# EAGLE schematic F6779 Ver 2.1 (EAGLE 7.7.0)

## Sheet 1 of 4
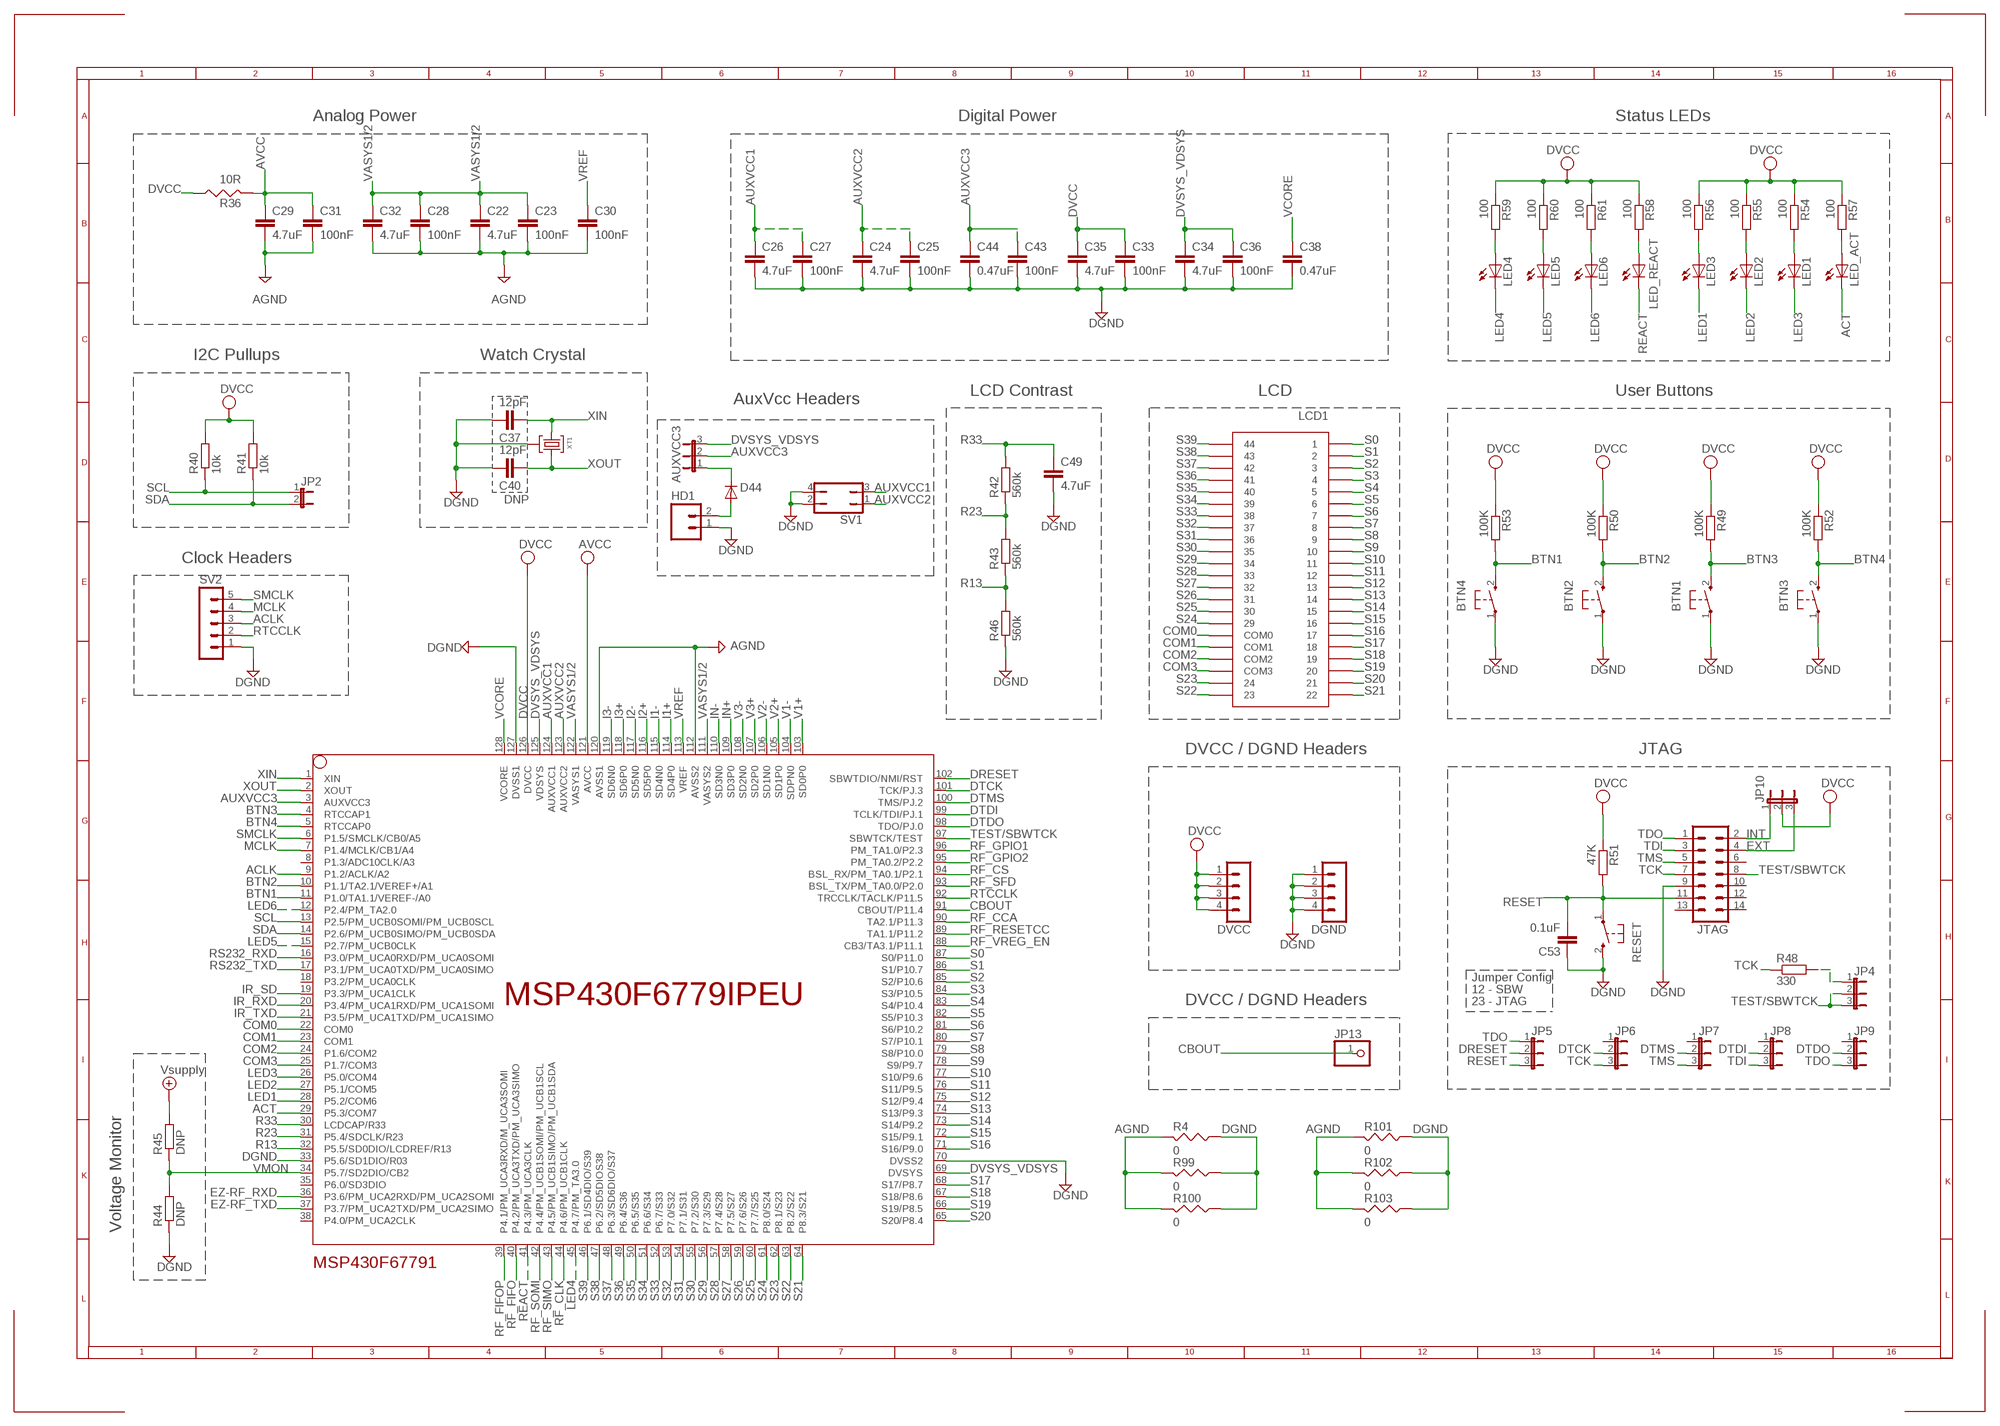
[diagram p0: schematic, sheet 1]

### Parts
AUXVCC3  JP2E  [JP2]
BTN1  PB  [PBTH]
BTN2  PB  [PBTH]
BTN3  PB  [PBTH]
BTN4  PB  [PBTH]
C22  4.7uF  C-EUC0603  [C0603]
C23  100nF  C-EUC0603  [C0603]
C24  4.7uF  C-EUC0603  [C0603]
C25  100nF  C-EUC0603  [C0603]
C26  4.7uF  C-EUC0603  [C0603]
C27  100nF  C-EUC0603  [C0603]
C28  100nF  C-EUC0603  [C0603]
C29  4.7uF  C-EUC0603  [C0603]
C30  100nF  C-EUC0603  [C0603]
C31  100nF  C-EUC0603  [C0603]
C32  4.7uF  C-EUC0603  [C0603]
C33  100nF  C-EUC0603  [C0603]
C34  4.7uF  C-EUC0603  [C0603]
C35  4.7uF  C-EUC0603  [C0603]
C36  100nF  C-EUC0603  [C0603]
C37  12pF  C-EUC0603  [C0603]
C38  0.47uF  C-EUC0603  [C0603]
C40  12pF  C-EUC0603  [C0603]
C43  100nF  C-EUC0603  [C0603]
C44  0.47uF  C-EUC0603  [C0603]
C49  4.7uF  C-EUC0603  [C0603]
C53  0.1uF  C-EUC0603  [C0603]
D44  PMLL4148  [SOD80C]
DGND  MA04-1  [MA04-1]
DVCC  MA04-1  [MA04-1]
HD1  M02PTH  [1X02]
JP2  JP1E  [JP1]
JP4  JP2E  [JP2]
JP5  JP2E  [JP2]
JP6  JP2E  [JP2]
JP7  JP2E  [JP2]
JP8  JP2E  [JP2]
JP9  JP2E  [JP2]
JP10  JP2E  [JP2]
JP13  PINHD-1X1  [1X01]
JTAG  ML14  [ML14]
LCD1  TI_160SEG_LCD  [TI_160SEG_LCD]
LED1  LED3MM  [LED3MM]
LED2  LED3MM  [LED3MM]
LED3  LED3MM  [LED3MM]
LED4  LED3MM  [LED3MM]
LED5  LED3MM  [LED3MM]
LED6  LED3MM  [LED3MM]
LED_ACT  LED3MM  [LED3MM]
LED_REACT  LED3MM  [LED3MM]
MSP430F67791  MSP430F6779IPEU  [PEU128]
R4  0  RES0805  [R0805]
R36  10R  RES0805  [R0805]
R40  10k  R-EU_R0603  [R0603]
R41  10k  R-EU_R0603  [R0603]
R42  560k  R-EU_R0603  [R0603]
R43  560k  R-EU_R0603  [R0603]
R44  DNP  R-EU_R0603  [R0603]
R45  DNP  R-EU_R0603  [R0603]
R46  560k  R-EU_R0603  [R0603]
R48  330  R-EU_R0603  [R0603]
R49  100K  R-EU_R0603  [R0603]
R50  100K  R-EU_R0603  [R0603]
R51  47K  R-EU_R0603  [R0603]
R52  100K  R-EU_R0603  [R0603]
R53  100K  R-EU_R0603  [R0603]
R54  100  R-EU_R0603  [R0603]
R55  100  R-EU_R0603  [R0603]
R56  100  R-EU_R0603  [R0603]
R57  100  R-EU_R0603  [R0603]
R58  100  R-EU_R0603  [R0603]
R59  100  R-EU_R0603  [R0603]
R60  100  R-EU_R0603  [R0603]
R61  100  R-EU_R0603  [R0603]
R99  0  RES0805  [R0805]
R100  0  RES0805  [R0805]
R101  0  RES0805  [R0805]
R102  0  RES0805  [R0805]
R103  0  RES0805  [R0805]
RESET  PB  [PBTH]
SV1  JP2Q  [JP2Q]
SV2  MA05-1  [MA05-1]
XT1  CM200T  [CM200T]

### Nets
ACLK: MSP430F67791.9(P1.2/ACLK/A2) SV2.3
ACT: LED_ACT.K(C) MSP430F67791.29(P5.3/COM7) ; also sheet 4
AGND: C22.2 C23.2 C28.2 C29.2 C30.2 C31.2 C32.2 MSP430F67791.112(AVSS2) MSP430F67791.120(AVSS1) R4.2 R99.2 R100.2 R101.2 R102.2 R103.2 ; also sheet 2
AUXVCC1: C26.1 C27.1 MSP430F67791.124(AUXVCC1) SV1.3
AUXVCC2: C24.1 C25.1 MSP430F67791.123(AUXVCC2) SV1.1
AUXVCC3: AUXVCC3.2 C43.1 C44.1 MSP430F67791.3(AUXVCC3)
AVCC: C29.1 C31.1 MSP430F67791.121(AVCC) R36.2 ; also sheet 2
BTN1: BTN4.2(S) MSP430F67791.11(P1.0/TA1.1/VEREF-/A0) R53.2
BTN2: BTN2.2(S) MSP430F67791.10(P1.1/TA2.1/VEREF+/A1) R50.2
BTN3: BTN1.2(S) MSP430F67791.4(RTCCAP1) R49.2
BTN4: BTN3.2(S) MSP430F67791.5(RTCCAP0) R52.2
CBOUT: JP13.1 MSP430F67791.91(CBOUT/P11.4)
COM0: LCD1.COM0 MSP430F67791.22(COM0)
COM1: LCD1.COM1 MSP430F67791.23(COM1)
COM2: LCD1.COM2 MSP430F67791.24(P1.6/COM2)
COM3: LCD1.COM3 MSP430F67791.25(P1.7/COM3)
DGND: BTN1.1(P) BTN2.1(P) BTN3.1(P) BTN4.1(P) C24.2 C25.2 C26.2 C27.2 C33.2 C34.2 C35.2 C36.2 C37.2 C38.2 C40.2 C43.2 C44.2 C49.2 C53.1 DGND.1 DGND.2 DGND.3 DGND.4 HD1.1 JTAG.9 MSP430F67791.33(P5.6/SD1DIO/R03) MSP430F67791.70(DVSS2) MSP430F67791.127(DVSS1) R4.1 R44.1 R46.1 R99.1 R100.1 R101.1 R102.1 R103.1 RESET.2(S) SV1.2 SV1.4 SV2.1 XT1.P3 ; also sheet 3,4
DRESET: JP5.2 MSP430F67791.102(SBWTDIO/NMI/RST)
DTCK: JP6.2 MSP430F67791.101(TCK/PJ.3)
DTDI: JP8.2 MSP430F67791.99(TCLK/TDI/PJ.1)
DTDO: JP9.2 MSP430F67791.98(TDO/PJ.0)
DTMS: JP7.2 MSP430F67791.100(TMS/PJ.2)
DVCC: C33.1 C35.1 DVCC.1 DVCC.2 DVCC.3 DVCC.4 JP10.2 MSP430F67791.126(DVCC) R36.1 R40.2 R41.2 R49.1 R50.1 R51.1 R52.1 R53.1 R54.1 R55.1 R56.1 R57.1 R58.1 R59.1 R60.1 R61.1 ; also sheet 3,4
DVSYS_VDSYS: AUXVCC3.3 C34.1 C36.1 MSP430F67791.69(DVSYS) MSP430F67791.125(VDSYS)
EXT: JP10.3 JTAG.4
EZ-RF_RXD: MSP430F67791.36(P3.6/PM_UCA2RXD/PM_UCA2SOMI) ; also sheet 4
EZ-RF_TXD: MSP430F67791.37(P3.7/PM_UCA2TXD/PM_UCA2SIMO) ; also sheet 4
I1+: MSP430F67791.114(SD4P0) ; also sheet 2
I1-: MSP430F67791.115(SD4N0) ; also sheet 2
I2+: MSP430F67791.116(SD5P0) ; also sheet 2
I2-: MSP430F67791.117(SD5N0) ; also sheet 2
I3+: MSP430F67791.118(SD6P0) ; also sheet 2
I3-: MSP430F67791.119(SD6N0) ; also sheet 2
IN+: MSP430F67791.109(SD3P0) ; also sheet 2
IN-: MSP430F67791.110(SD3N0) ; also sheet 2
INT: JP10.1 JTAG.2
IR_RXD: MSP430F67791.20(P3.4/PM_UCA1RXD/PM_UCA1SOMI) ; also sheet 4
IR_SD: MSP430F67791.19(P3.3/PM_UCA1CLK) ; also sheet 4
IR_TXD: MSP430F67791.21(P3.5/PM_UCA1TXD/PM_UCA1SIMO) ; also sheet 4
LED1: LED3.K(C) MSP430F67791.28(P5.2/COM6)
LED2: LED2.K(C) MSP430F67791.27(P5.1/COM5)
LED3: LED1.K(C) MSP430F67791.26(P5.0/COM4)
LED4: LED4.K(C) MSP430F67791.45(P4.7/PM_TA3.0)
LED5: LED5.K(C) MSP430F67791.15(P2.7/PM_UCB0CLK)
LED6: LED6.K(C) MSP430F67791.12(P2.4/PM_TA2.0)
MCLK: MSP430F67791.7(P1.4/MCLK/CB1/A4) SV2.4
N$4: LED3.A R56.2
N$5: AUXVCC3.1 D44.C
N$7: LED2.A R55.2
N$10: JP4.1 R48.2
N$21: LED4.A R59.2
N$27: LED5.A R60.2
N$30: LED1.A R54.2
N$36: LED6.A R61.2
N$44: LED_REACT.A R58.2
N$46: LED_ACT.A R57.2
N$49: D44.A HD1.2
R13: MSP430F67791.32(P5.5/SD0DIO/LCDREF/R13) R43.1 R46.2
R23: MSP430F67791.31(P5.4/SDCLK/R23) R42.1 R43.2
R33: C49.1 MSP430F67791.30(LCDCAP/R33) R42.2
REACT: LED_REACT.K(C) MSP430F67791.41(P4.3/PM_UCA3CLK) ; also sheet 4
RESET: C53.2 JP5.3 JTAG.11 R51.2 RESET.1(P)
RF_CCA: MSP430F67791.90(TA2.1/P11.3) ; also sheet 4
RF_CLK: MSP430F67791.44(P4.6/PM_UCB1CLK) ; also sheet 4
RF_CS: MSP430F67791.94(BSL_RX/PM_TA0.1/P2.1) ; also sheet 4
RF_FIFO: MSP430F67791.40(P4.2/PM_UCA3TXD/PM_UCA3SIMO) ; also sheet 4
RF_FIFOP: MSP430F67791.39(P4.1/PM_UCA3RXD/M_UCA3SOMI) ; also sheet 4
RF_GPIO1: MSP430F67791.96(PM_TA1.0/P2.3) ; also sheet 4
RF_GPIO2: MSP430F67791.95(PM_TA0.2/P2.2) ; also sheet 4
RF_RESETCC: MSP430F67791.89(TA1.1/P11.2) ; also sheet 4
RF_SFD: MSP430F67791.93(BSL_TX/PM_TA0.0/P2.0) ; also sheet 4
RF_SIMO: MSP430F67791.43(P4.5/PM_UCB1SIMO/PM_UCB1SDA) ; also sheet 4
RF_SOMI: MSP430F67791.42(P4.4/PM_UCB1SOMI/PM_UCB1SCL) ; also sheet 4
RF_VREG_EN: MSP430F67791.88(CB3/TA3.1/P11.1) ; also sheet 4
RS232_RXD: MSP430F67791.16(P3.0/PM_UCA0RXD/PM_UCA0SOMI) ; also sheet 4
RS232_TXD: MSP430F67791.17(P3.1/PM_UCA0TXD/PM_UCA0SIMO) ; also sheet 4
RTCCLK: MSP430F67791.92(TRCCLK/TACLK/P11.5) SV2.2
S0: LCD1.1 MSP430F67791.87(S0/P11.0)
S1: LCD1.2 MSP430F67791.86(S1/P10.7)
S2: LCD1.3 MSP430F67791.85(S2/P10.6)
S3: LCD1.4 MSP430F67791.84(S3/P10.5)
S4: LCD1.5 MSP430F67791.83(S4/P10.4)
S5: LCD1.6 MSP430F67791.82(S5/P10.3)
S6: LCD1.7 MSP430F67791.81(S6/P10.2)
S7: LCD1.8 MSP430F67791.80(S7/P10.1)
S8: LCD1.9 MSP430F67791.79(S8/P10.0)
S9: LCD1.10 MSP430F67791.78(S9/P9.7)
S10: LCD1.11 MSP430F67791.77(S10/P9.6)
S11: LCD1.12 MSP430F67791.76(S11/P9.5)
S12: LCD1.13 MSP430F67791.75(S12/P9.4)
S13: LCD1.14 MSP430F67791.74(S13/P9.3)
S14: LCD1.15 MSP430F67791.73(S14/P9.2)
S15: LCD1.16 MSP430F67791.72(S15/P9.1)
S16: LCD1.17 MSP430F67791.71(S16/P9.0)
S17: LCD1.18 MSP430F67791.68(S17/P8.7)
S18: LCD1.19 MSP430F67791.67(S18/P8.6)
S19: LCD1.20 MSP430F67791.66(S19/P8.5)
S20: LCD1.21 MSP430F67791.65(S20/P8.4)
S21: LCD1.22 MSP430F67791.64(P8.3/S21)
S22: LCD1.23 MSP430F67791.63(P8.2/S22)
S23: LCD1.24 MSP430F67791.62(P8.1/S23)
S24: LCD1.29 MSP430F67791.61(P8.0/S24)
S25: LCD1.30 MSP430F67791.60(P7.7/S25)
S26: LCD1.31 MSP430F67791.59(P7.6/S26)
S27: LCD1.32 MSP430F67791.58(P7.5/S27)
S28: LCD1.33 MSP430F67791.57(P7.4/S28)
S29: LCD1.34 MSP430F67791.56(P7.3/S29)
S30: LCD1.35 MSP430F67791.55(P7.2/S30)
S31: LCD1.36 MSP430F67791.54(P7.1/S31)
S32: LCD1.37 MSP430F67791.53(P7.0/S32)
S33: LCD1.38 MSP430F67791.52(P6.7/S33)
S34: LCD1.39 MSP430F67791.51(P6.6/S34)
S35: LCD1.40 MSP430F67791.50(P6.5/S35)
S36: LCD1.41 MSP430F67791.49(P6.4/S36)
S37: LCD1.42 MSP430F67791.48(P6.3/SD6DIO/S37)
S38: LCD1.43 MSP430F67791.47(P6.2/SD5DIOS38)
S39: LCD1.44 MSP430F67791.46(P6.1/SD4DIO/S39)
SCL: JP2.1 MSP430F67791.13(P2.5/PM_UCB0SOMI/PM_UCB0SCL) R40.1 ; also sheet 4
SDA: JP2.2 MSP430F67791.14(P2.6/PM_UCB0SIMO/PM_UCB0SDA) R41.1 ; also sheet 4
SMCLK: MSP430F67791.6(P1.5/SMCLK/CB0/A5) SV2.5
TCK: JP6.3 JTAG.7 R48.1
TDI: JP8.3 JTAG.3
TDO: JP5.1 JP9.3 JTAG.1
TEST/SBWTCK: JP4.2 JP4.3 JTAG.8 MSP430F67791.97(SBWTCK/TEST)
TMS: JP7.3 JTAG.5
V1+: MSP430F67791.103(SD0P0) ; also sheet 2
V1-: MSP430F67791.104(SDPN0) ; also sheet 2
V2+: MSP430F67791.105(SD1P0) ; also sheet 2
V2-: MSP430F67791.106(SD1N0) ; also sheet 2
V3+: MSP430F67791.107(SD2P0) ; also sheet 2
V3-: MSP430F67791.108(SD2N0) ; also sheet 2
VASYS1/2: C22.1 C23.1 C28.1 C32.1 MSP430F67791.111(VASYS2) MSP430F67791.122(VASYS1)
VCORE: C38.1 MSP430F67791.128(VCORE)
VMON: MSP430F67791.34(P5.7/SD2DIO/CB2) R44.2 R45.1
VREF: C30.1 MSP430F67791.113(VREF)
VSUPPLY: R45.2 ; supply symbol labelled Vsupply ; also sheet 3
XIN: C37.1 MSP430F67791.1(XIN) XT1.P2
XOUT: C40.1 MSP430F67791.2(XOUT) XT1.P1
Unconnected: JP6.1 JP7.1 JP8.1 JP9.1 JTAG.6 JTAG.10 JTAG.12 JTAG.13 JTAG.14 MSP430F67791.8(P1.3/ADC10CLK/A3) MSP430F67791.18(P3.2/PM_UCA0CLK) MSP430F67791.35(P6.0/SD3DIO) MSP430F67791.38(P4.0/PM_UCA2CLK)

### Notes on the sheet
- Analog Power | Digital Power | Status LEDs
- I2C Pullups | Watch Crystal
- LCD Contrast | LCD | User Buttons
- AuxVcc Headers
- DNP
- Clock Headers
- DVCC / DGND Headers | JTAG
- Jumper Config
- 12 - SBW
- DVCC / DGND Headers | 23 - JTAG
- Voltage Monitor

## Sheet 2 of 4
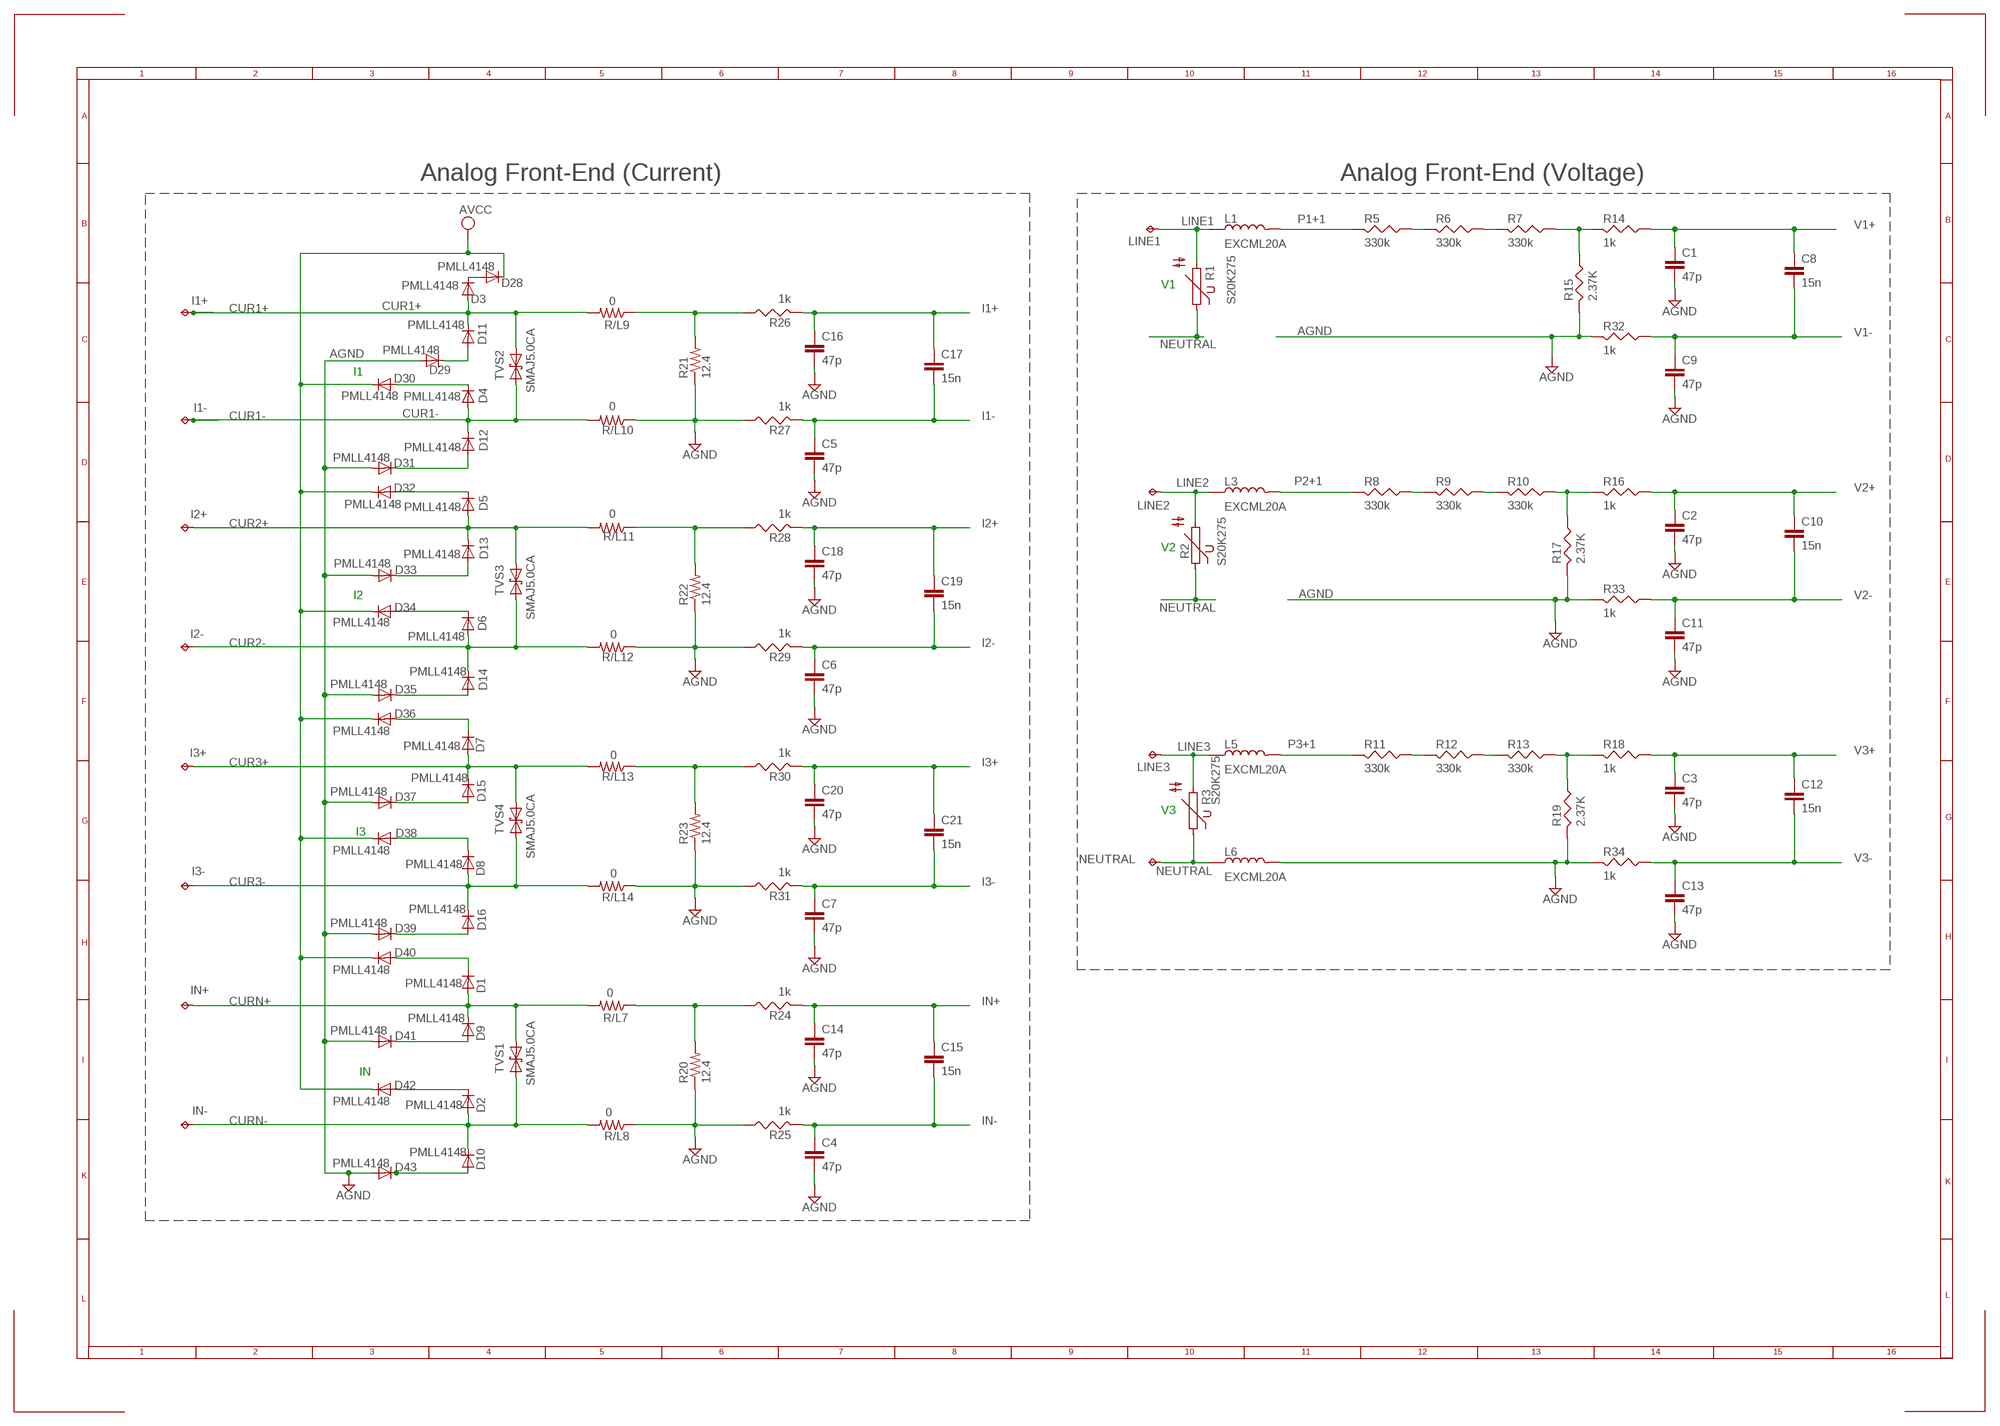
[diagram p1: schematic, sheet 2]

### Parts
C1  47p  C-EUC0805  [C0805]
C2  47p  C-EUC0805  [C0805]
C3  47p  C-EUC0805  [C0805]
C4  47p  C-EUC0805  [C0805]
C5  47p  C-EUC0805  [C0805]
C6  47p  C-EUC0805  [C0805]
C7  47p  C-EUC0805  [C0805]
C8  15n  C-EUC0805  [C0805]
C9  47p  C-EUC0805  [C0805]
C10  15n  C-EUC0805  [C0805]
C11  47p  C-EUC0805  [C0805]
C12  15n  C-EUC0805  [C0805]
C13  47p  C-EUC0805  [C0805]
C14  47p  C-EUC0805  [C0805]
C15  15n  C-EUC0805  [C0805]
C16  47p  C-EUC0805  [C0805]
C17  15n  C-EUC0805  [C0805]
C18  47p  C-EUC0805  [C0805]
C19  15n  C-EUC0805  [C0805]
C20  47p  C-EUC0805  [C0805]
C21  15n  C-EUC0805  [C0805]
D1  PMLL4148  [SOD80C]
D2  PMLL4148  [SOD80C]
D3  PMLL4148  [SOD80C]
D4  PMLL4148  [SOD80C]
D5  PMLL4148  [SOD80C]
D6  PMLL4148  [SOD80C]
D7  PMLL4148  [SOD80C]
D8  PMLL4148  [SOD80C]
D9  PMLL4148  [SOD80C]
D10  PMLL4148  [SOD80C]
D11  PMLL4148  [SOD80C]
D12  PMLL4148  [SOD80C]
D13  PMLL4148  [SOD80C]
D14  PMLL4148  [SOD80C]
D15  PMLL4148  [SOD80C]
D16  PMLL4148  [SOD80C]
D28  PMLL4148  [SOD80C]
D29  PMLL4148  [SOD80C]
D30  PMLL4148  [SOD80C]
D31  PMLL4148  [SOD80C]
D32  PMLL4148  [SOD80C]
D33  PMLL4148  [SOD80C]
D34  PMLL4148  [SOD80C]
D35  PMLL4148  [SOD80C]
D36  PMLL4148  [SOD80C]
D37  PMLL4148  [SOD80C]
D38  PMLL4148  [SOD80C]
D39  PMLL4148  [SOD80C]
D40  PMLL4148  [SOD80C]
D41  PMLL4148  [SOD80C]
D42  PMLL4148  [SOD80C]
D43  PMLL4148  [SOD80C]
I1+  TPPAD1-20  [P1-20]
I1-  TPPAD1-20  [P1-20]
I2+  TPPAD1-20  [P1-20]
I2-  TPPAD1-20  [P1-20]
I3+  TPPAD1-20  [P1-20]
I3-  TPPAD1-20  [P1-20]
IN+  TPPAD1-20  [P1-20]
IN-  TPPAD1-20  [P1-20]
L1  EXCML20A  EXCELSA390805  [R0805]
L3  EXCML20A  EXCELSA390805  [R0805]
L5  EXCML20A  EXCELSA390805  [R0805]
L6  EXCML20A  EXCELSA390805  [R0805]
LINE1  TPPAD1-20  [P1-20]
LINE2  TPPAD1-20  [P1-20]
LINE3  TPPAD1-20  [P1-20]
NEUTRAL  TPPAD1-20  [P1-20]
R1  S20K275  [S20K275]
R2  S20K275  [S20K275]
R3  S20K275  [S20K275]
R5  330k  RES0805  [R0805]
R6  330k  RES0805  [R0805]
R7  330k  RES0805  [R0805]
R8  330k  RES0805  [R0805]
R9  330k  RES0805  [R0805]
R10  330k  RES0805  [R0805]
R11  330k  RES0805  [R0805]
R12  330k  RES0805  [R0805]
R13  330k  RES0805  [R0805]
R14  1k  RES0805  [R0805]
R15  2.37K  RES0805  [R0805]
R16  1k  RES0805  [R0805]
R17  2.37K  RES0805  [R0805]
R18  1k  RES0805  [R0805]
R19  2.37K  RES0805  [R0805]
R20  12.4  R-US_R0805  [R0805]
R21  12.4  R-US_R0805  [R0805]
R22  12.4  R-US_R0805  [R0805]
R23  12.4  R-US_R0805  [R0805]
R24  1k  RES0805  [R0805]
R25  1k  RES0805  [R0805]
R26  1k  RES0805  [R0805]
R27  1k  RES0805  [R0805]
R28  1k  RES0805  [R0805]
R29  1k  RES0805  [R0805]
R30  1k  RES0805  [R0805]
R31  1k  RES0805  [R0805]
R32  1k  RES0805  [R0805]
R33  1k  RES0805  [R0805]
R34  1k  RES0805  [R0805]
R/L7  0  R-US_R0805  [R0805]
R/L8  0  R-US_R0805  [R0805]
R/L9  0  R-US_R0805  [R0805]
R/L10  0  R-US_R0805  [R0805]
R/L11  0  R-US_R0805  [R0805]
R/L12  0  R-US_R0805  [R0805]
R/L13  0  R-US_R0805  [R0805]
R/L14  0  R-US_R0805  [R0805]
TVS1  SMAJ5.0CA  [DO214AC]
TVS2  SMAJ5.0CA  [DO214AC]
TVS3  SMAJ5.0CA  [DO214AC]
TVS4  SMAJ5.0CA  [DO214AC]

### Nets
AGND: C1.2 C2.2 C3.2 C4.2 C5.2 C6.2 C7.2 C9.2 C11.2 C13.2 C14.2 C16.2 C18.2 C20.2 D29.A D31.A D33.A D35.A D37.A D39.A D41.A D43.A L6.2 R15.2 R17.2 R19.2 R20.1 R21.1 R22.1 R23.1 R25.1 R27.1 R29.1 R31.1 R32.2 R33.2 R34.2 R/L8.1 R/L10.1 R/L12.1 R/L14.1 ; also sheet 1
AVCC: D28.C D30.C D32.C D34.C D36.C D38.C D40.C D42.C ; also sheet 1
CUR1+: D3.A D11.C I1+.TP R/L9.2 TVS2.C(K)
CUR1-: D4.A D12.C I1-.TP R/L10.2 TVS2.A
CUR2+: D5.A D13.C I2+.TP R/L11.2 TVS3.C(K)
CUR2-: D6.A D14.C I2-.TP R/L12.2 TVS3.A
CUR3+: D7.A D15.C I3+.TP R/L13.2 TVS4.C(K)
CUR3-: D8.A D16.C I3-.TP R/L14.2 TVS4.A
CURN+: D1.A D9.C IN+.TP R/L7.2 TVS1.C(K)
CURN-: D2.A D10.C IN-.TP R/L8.2 TVS1.A
I1+: C16.1 C17.1 R26.2 ; also sheet 1
I1-: C5.1 C17.2 R27.2 ; also sheet 1
I2+: C18.1 C19.1 R28.2 ; also sheet 1
I2-: C6.1 C19.2 R29.2 ; also sheet 1
I3+: C20.1 C21.1 R30.2 ; also sheet 1
I3-: C7.1 C21.2 R31.2 ; also sheet 1
IN+: C14.1 C15.1 R24.2 ; also sheet 1
IN-: C4.1 C15.2 R25.2 ; also sheet 1
LINE1: L1.1 LINE1.TP R1.2
LINE2: L3.1 LINE2.TP R2.2
LINE3: L5.1 LINE3.TP R3.2
N$6: R20.2 R24.1 R/L7.1
N$8: R5.1 R6.2
N$13: R6.1 R7.2
N$14: R7.1 R14.2 R15.1
N$15: R8.1 R9.2
N$16: R9.1 R10.2
N$19: R10.1 R16.2 R17.1
N$20: D3.C D28.A
N$23: D11.A D29.C
N$25: R23.2 R30.1 R/L13.1
N$29: R11.1 R12.2
N$31: R22.2 R28.1 R/L11.1
N$32: R21.2 R26.1 R/L9.1
N$33: R12.1 R13.2
N$34: R13.1 R18.2 R19.1
N$39: D4.C D30.A
N$40: D12.A D31.C
N$42: D5.C D32.A
N$54: D13.A D33.C
N$62: D6.C D34.A
N$63: D14.A D35.C
N$64: D7.C D36.A
N$66: D15.A D37.C
N$70: D8.C D38.A
N$73: D16.A D39.C
N$74: D1.C D40.A
N$75: D9.A D41.C
N$76: D2.C D42.A
N$77: D10.A D43.C
NEUTRAL: L6.1 NEUTRAL.TP R1.1 R2.1 R3.1 ; also sheet 3
P1+1: L1.2 R5.2 ; also sheet 3
P2+1: L3.2 R8.2 ; also sheet 3
P3+1: L5.2 R11.2 ; also sheet 3
V1+: C1.1 C8.1 R14.1 ; also sheet 1
V1-: C8.2 C9.1 R32.1 ; also sheet 1
V2+: C2.1 C10.1 R16.1 ; also sheet 1
V2-: C10.2 C11.1 R33.1 ; also sheet 1
V3+: C3.1 C12.1 R18.1 ; also sheet 1
V3-: C12.2 C13.1 R34.1 ; also sheet 1

### Notes on the sheet
- Analog Front-End (Current) | Analog Front-End (Voltage)
- V1
- I1
- V2
- I2
- V3
- I3
- IN

## Sheet 3 of 4
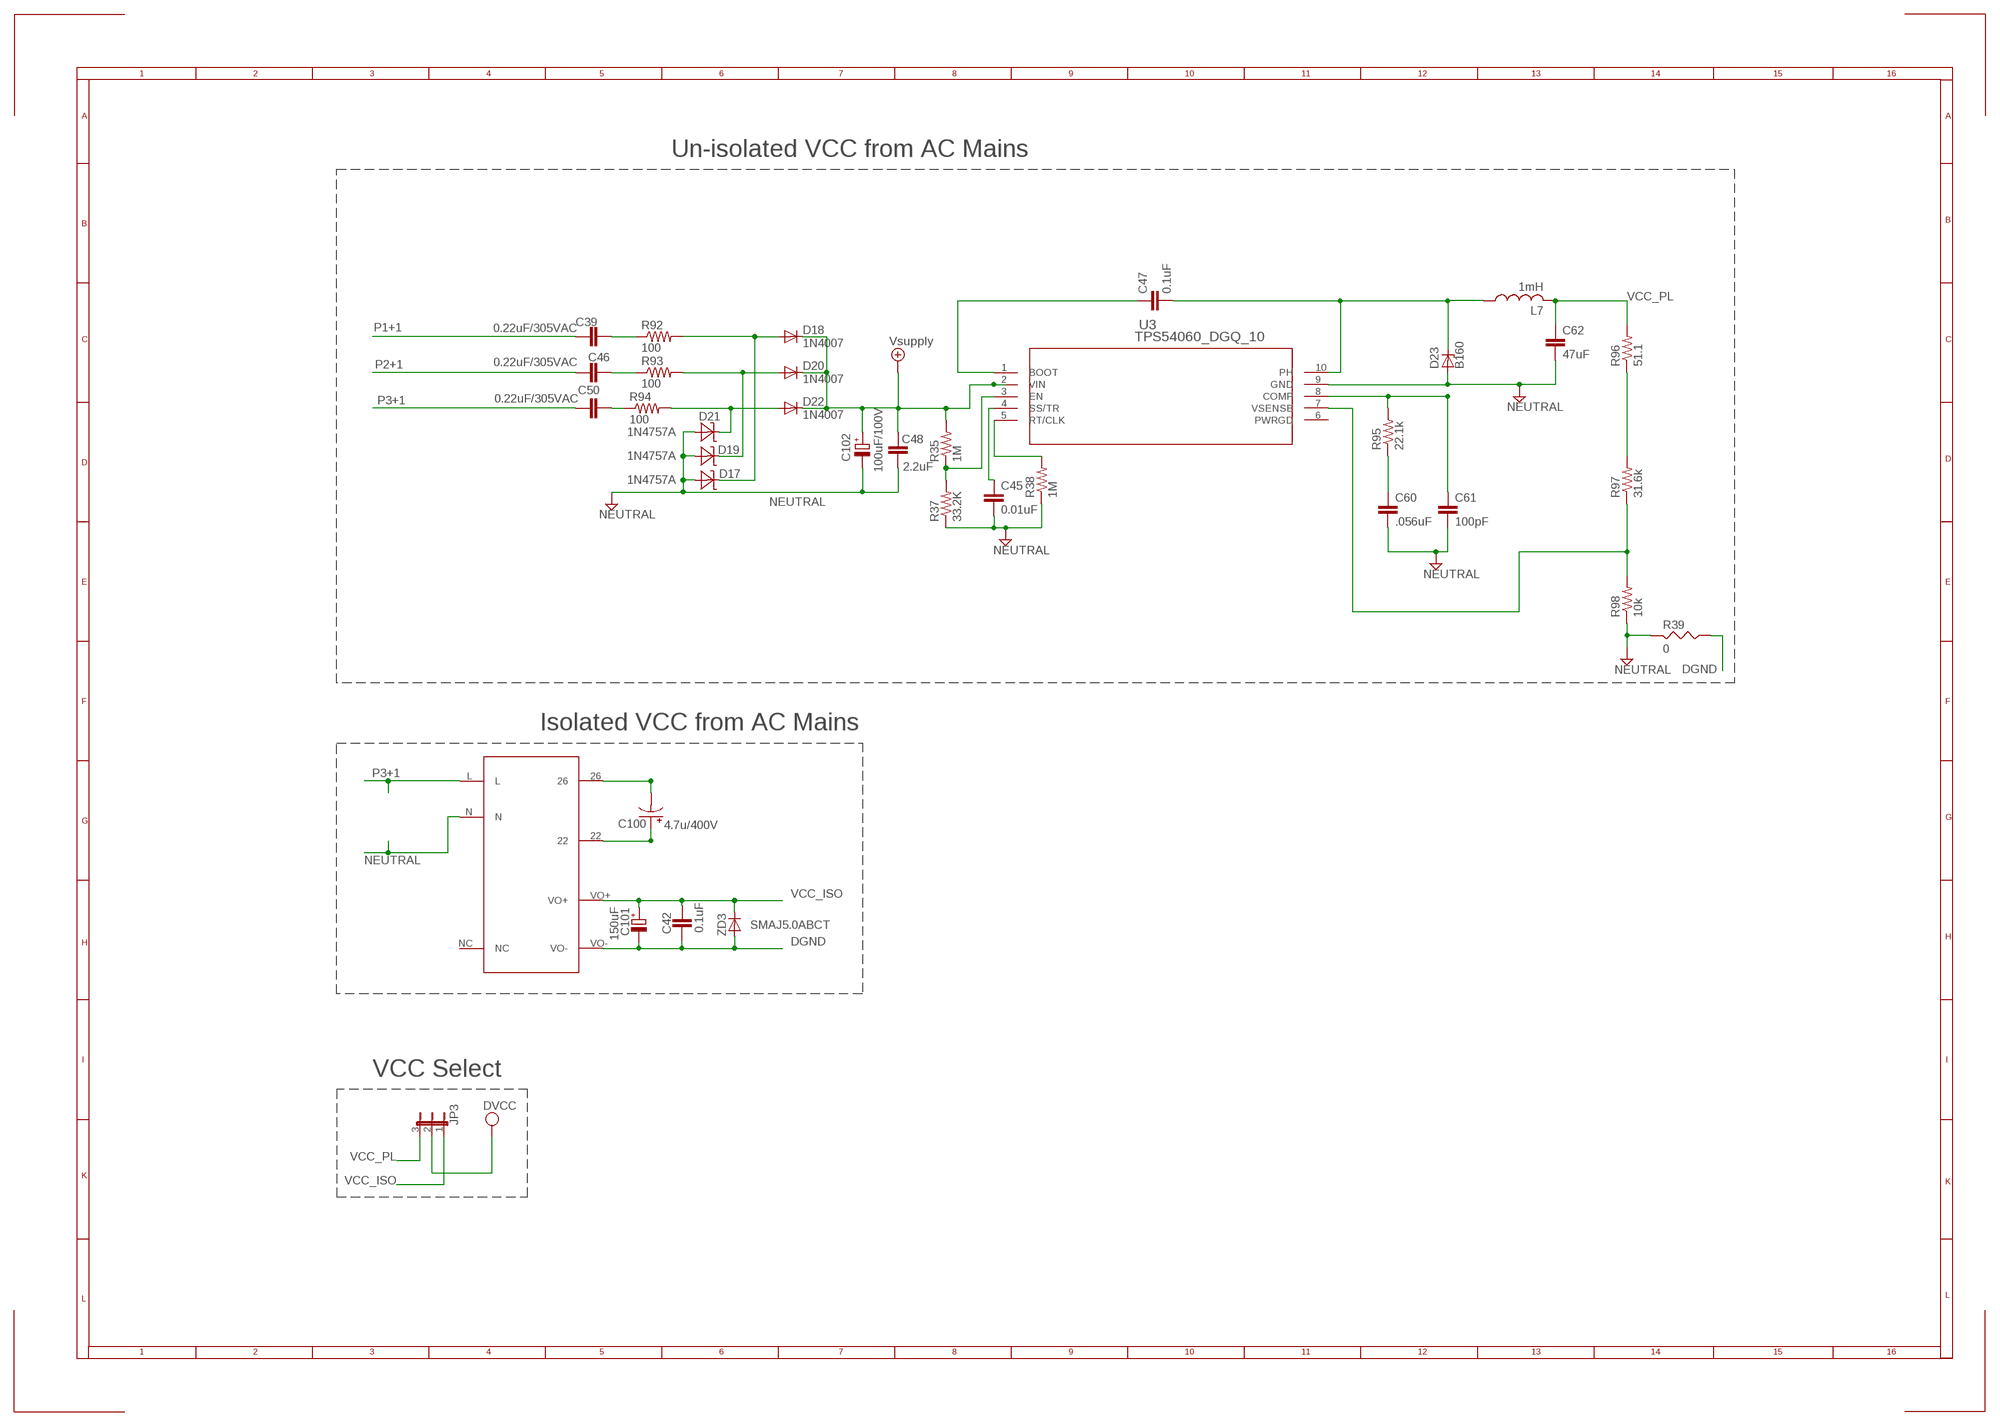
[diagram p2: schematic, sheet 3]

### Parts
C39  0.22uF/305VAC  C15/8  [C15B8]
C42  0.1uF  C-EUC0603  [C0603]
C45  0.01uF  C-EUC0603  [C0603]
C46  0.22uF/305VAC  C15/8  [C15B8]
C47  0.1uF  C-EUC0603  [C0603]
C48  2.2uF  C-EUC1210  [C1210]
C50  0.22uF/305VAC  C15/8  [C15B8]
C60  .056uF  C-EUC0603  [C0603]
C61  100pF  C-EUC0603  [C0603]
C62  47uF  C-EUC1210  [C1210]
C100  4.7u/400V  CPOL-USE5-10.5  [E5-10,5]
C101  150uF  CPOL-EUE2-5  [E2-5]
C102  100uF/100V  CPOL-EUE5-10.5  [E5-10,5]
D17  1N4757A  [DO41Z10]
D18  1N4007  [DO41-10]
D19  1N4757A  [DO41Z10]
D20  1N4007  [DO41-10]
D21  1N4757A  [DO41Z10]
D22  1N4007  [DO41-10]
D23  B160  ZENER-DIODESMB  [SMB]
JP3  JP2E  [JP2]
L7  1mH  L-USMSS1038-105  [INDUCTOR_POWER_SUPPLY_6779]
R35  1M  R-US_R0603  [R0603]
R37  33.2K  R-US_R0603  [R0603]
R38  1M  R-US_R0603  [R0603]
R39  0  RES0805  [R0805]
R92  100  R-US_0414/15  [0414/15]
R93  100  R-US_0414/15  [0414/15]
R94  100  R-US_0414/15  [0414/15]
R95  22.1k  R-US_R0603  [R0603]
R96  51.1  R-US_R0603  [R0603]
R97  31.6k  R-US_R0603  [R0603]
R98  10k  R-US_R0603  [R0603]
U3  TPS54060_DGQ_10  [DGQ10_1P88X1P57]
U$1  CUI_XR  [CUI_XR]
ZD3  SMAJ5.0ABCT  DIODE-DO214AC  [DO214AC]

### Nets
DGND: C42.2 C101.- R39.1 U$1.VO- ZD3.A ; also sheet 1,4
DVCC: JP3.2 ; also sheet 1,4
N$1: C100.- U$1.26
N$2: C100.+ U$1.22
N$17: R38.2 U3.5(RT/CLK)
N$18: D17.C D18.A R92.2
N$37: C45.1 U3.4(SS/TR)
N$38: R35.1 R37.2 U3.3(EN)
N$47: D19.C D20.A R93.2
N$78: C47.1 U3.1(BOOT)
N$80: C47.2 D23.C L7.1 U3.10(PH)
N$82: C60.1 R95.1
N$84: C39.2 R92.1
N$89: C46.2 R93.1
N$90: C50.2 R94.1
N$92: C61.1 R95.2 U3.8(COMP)
N$93: R96.1 R97.2
N$94: D21.C D22.A R94.2
N$95: R97.1 R98.2 U3.7(VSENSE)
NEUTRAL: C45.2 C48.2 C60.2 C61.2 C62.2 C102.- D17.A D19.A D21.A D23.A R37.1 R38.1 R39.2 R98.1 U3.9(GND) U$1.N ; also sheet 2
P1+1: C39.1 ; also sheet 2
P2+1: C46.1 ; also sheet 2
P3+1: C50.1 U$1.L ; also sheet 2
VCC_ISO: C42.1 C101.+ JP3.1 U$1.VO+ ZD3.C
VCC_PL: C62.1 JP3.3 L7.2 R96.2
VSUPPLY: C48.1 C102.+ D18.C D20.C D22.C R35.2 U3.2(VIN) ; supply symbol labelled Vsupply ; also sheet 1
Unconnected: U3.6(PWRGD) U$1.NC

### Notes on the sheet
- Un-isolated VCC from AC Mains
- Isolated VCC from AC Mains
- VCC Select

## Sheet 4 of 4
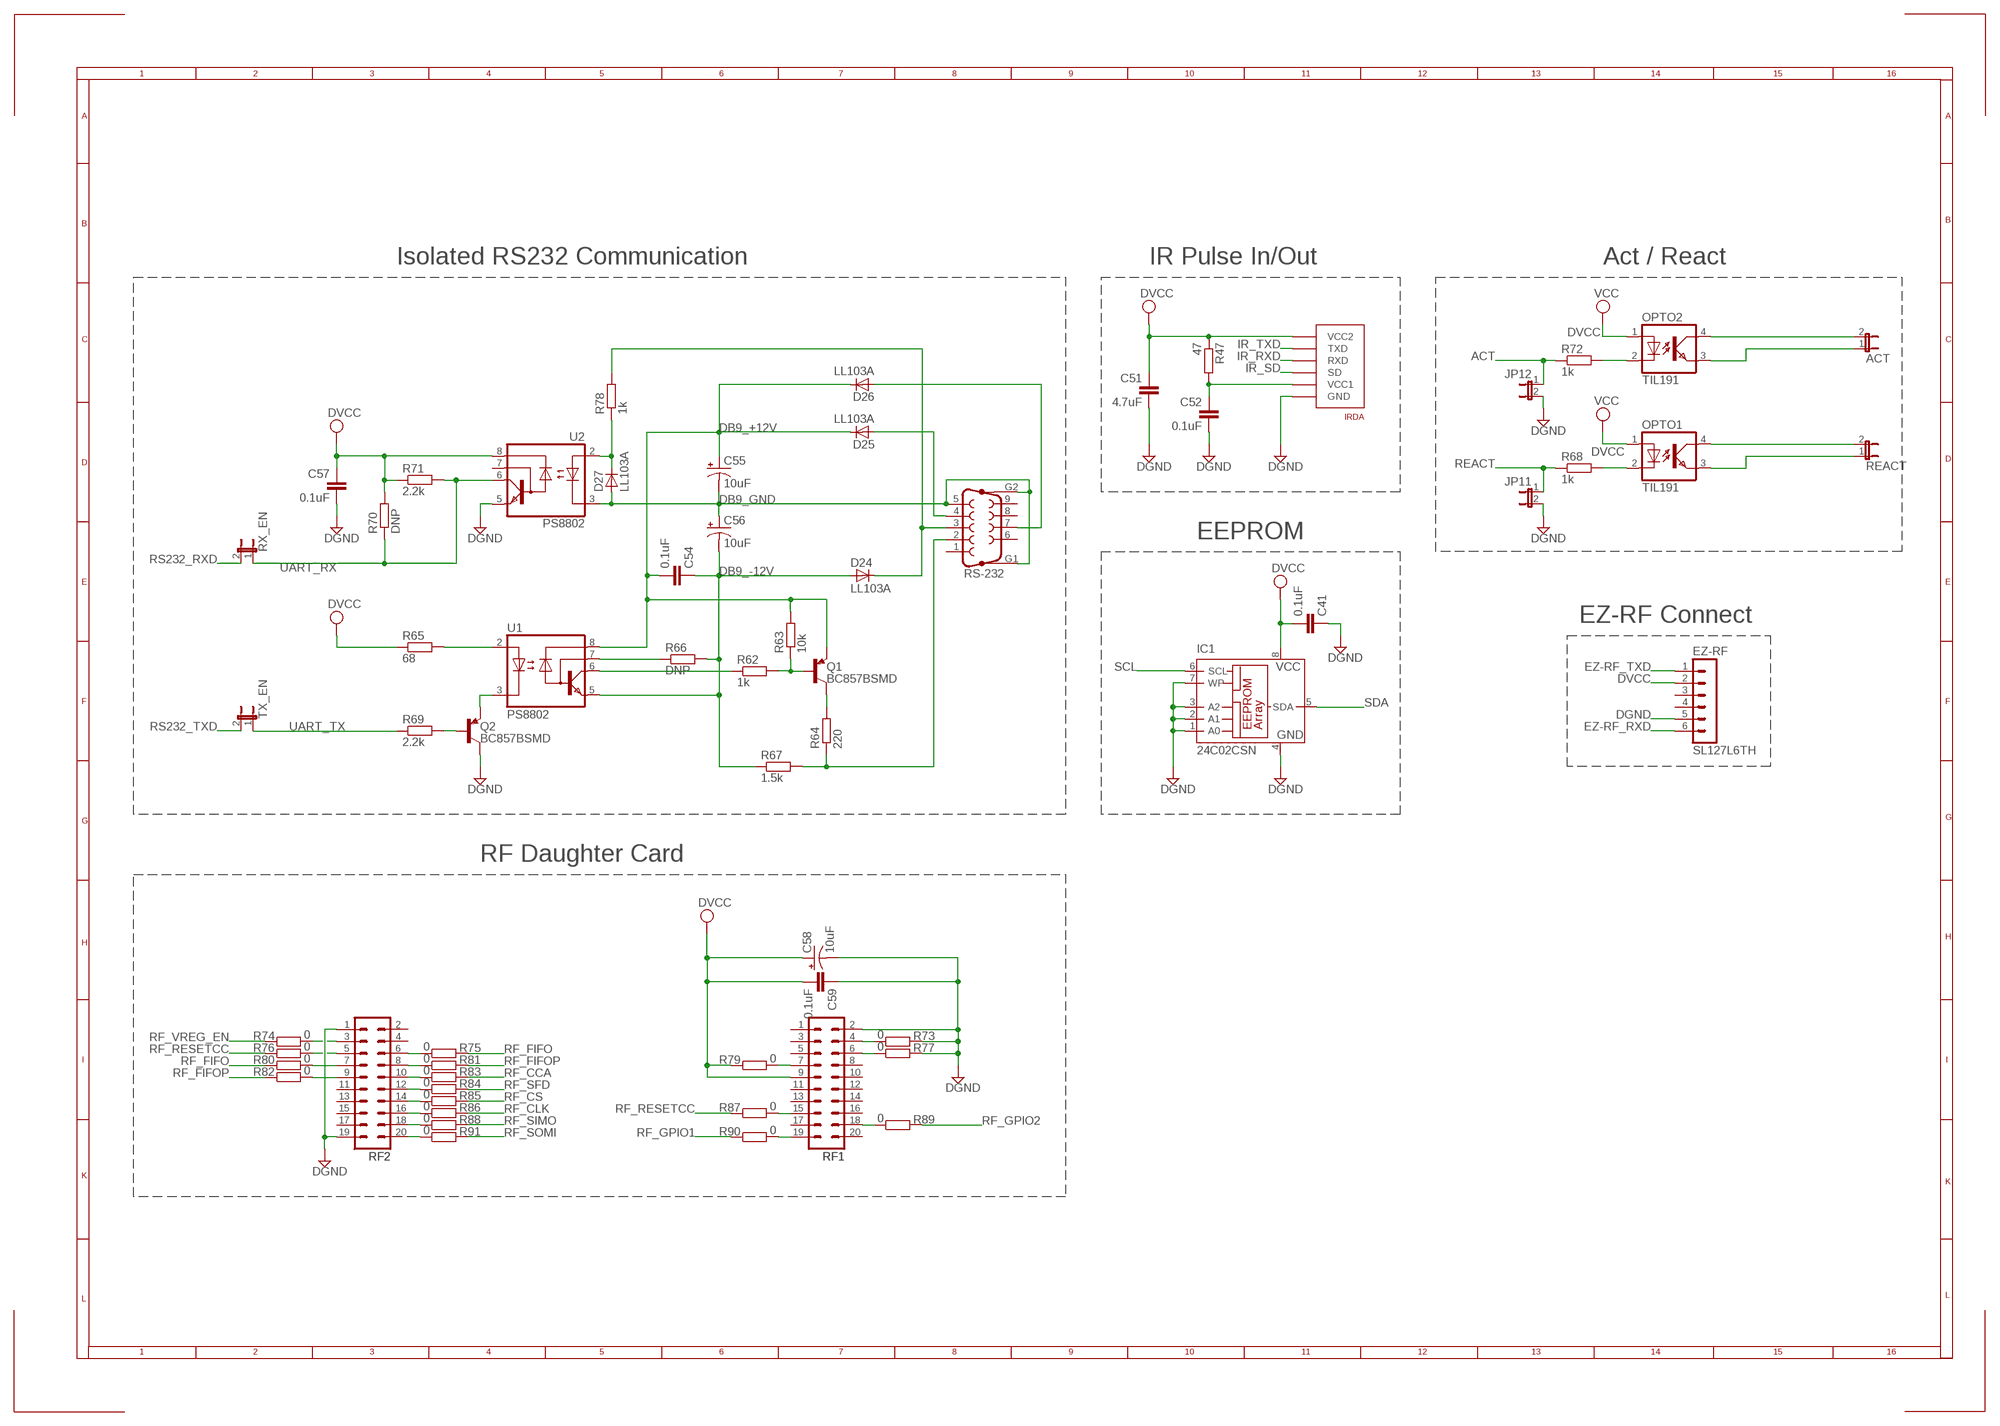
[diagram p3: schematic, sheet 4]

### Parts
ACT  JP1E  [JP1]
C41  0.1uF  C-EUC0603  [C0603]
C51  4.7uF  C-EUC0603  [C0603]
C52  0.1uF  C-EUC0603  [C0603]
C54  0.1uF  C-EUC0603  [C0603]
C55  10uF  CPOL-USCT3216  [CT3216]
C56  10uF  CPOL-USCT3216  [CT3216]
C57  0.1uF  C-EUC0603  [C0603]
C58  10uF  CPOL-USCT3216  [CT3216]
C59  0.1uF  C-EUC0603  [C0603]
D24  LL103A  D-SOD-80  [SOD80]
D25  LL103A  D-SOD-80  [SOD80]
D26  LL103A  D-SOD-80  [SOD80]
D27  LL103A  D-SOD-80  [SOD80]
EZ-RF  SL127L6TH  [SL127L6_MPE]
IC1  24C02CSN  [SO-08]
IRDA  TFBS4711-TT1  [TFBS4711]
JP11  JP1E  [JP1]
JP12  JP1E  [JP1]
OPTO1  TIL191  [DIL04]
OPTO2  TIL191  [DIL04]
Q1  BC857BSMD  [SOT23-BEC]
Q2  BC857BSMD  [SOT23-BEC]
R47  47  R-EU_R0603  [R0603]
R62  1k  R-EU_R0603  [R0603]
R63  10k  R-EU_R0603  [R0603]
R64  220  R-EU_R0603  [R0603]
R65  68  R-EU_R0603  [R0603]
R66  DNP  R-EU_R0603  [R0603]
R67  1.5k  R-EU_R0603  [R0603]
R68  1k  R-EU_R0603  [R0603]
R69  2.2k  R-EU_R0603  [R0603]
R70  DNP  R-EU_R0603  [R0603]
R71  2.2k  R-EU_R0603  [R0603]
R72  1k  R-EU_R0603  [R0603]
R73  0  R-EU_R0603  [R0603]
R74  0  R-EU_R0603  [R0603]
R75  0  R-EU_R0603  [R0603]
R76  0  R-EU_R0603  [R0603]
R77  0  R-EU_R0603  [R0603]
R78  1k  R-EU_R0603  [R0603]
R79  0  R-EU_R0603  [R0603]
R80  0  R-EU_R0603  [R0603]
R81  0  R-EU_R0603  [R0603]
R82  0  R-EU_R0603  [R0603]
R83  0  R-EU_R0603  [R0603]
R84  0  R-EU_R0603  [R0603]
R85  0  R-EU_R0603  [R0603]
R86  0  R-EU_R0603  [R0603]
R87  0  R-EU_R0603  [R0603]
R88  0  R-EU_R0603  [R0603]
R89  0  R-EU_R0603  [R0603]
R90  0  R-EU_R0603  [R0603]
R91  0  R-EU_R0603  [R0603]
REACT  JP1E  [JP1]
RF1  TFM-110-02-SM-D-A-K  [TFM-110-02-SM-D-A-K]
RF2  TFM-110-02-SM-D-A-K  [TFM-110-02-SM-D-A-K]
RS-232  F09VP  [F09VP]
RX_EN  JP1E  [JP1]
TX_EN  JP1E  [JP1]
U1  PS8802  [SO08]
U2  PS8802  [SO08]

### Nets
ACT: JP12.1 R72.1 ; also sheet 1
DB9_+12V: C54.2 C55.+ D25.1(C) D26.1(C) Q1.E R63.2 U1.8(VCC)
DB9_-12V: C54.1 C56.- D24.2(A) R66.2 R67.1 U1.5(GND)
DB9_GND: C55.- C56.+ D27.2(A) RS-232.5 RS-232.G1 RS-232.G2 U2.3(C)
DGND: C41.1 C51.2 C52.2 C57.2 C58.- C59.1 EZ-RF.5 IC1.1(A0) IC1.2(A1) IC1.3(A2) IC1.4(GND) IC1.7(WP) IRDA.P$6(GND) JP11.2 JP12.2 Q2.C R73.2 R77.2 RF1.2 RF2.1 RF2.19 U2.5(GND) ; also sheet 1,3
DVCC: C41.2 C51.1 C57.1 C58.+ C59.2 EZ-RF.2 IC1.8(VCC) IRDA.P$1(VCC2) OPTO1.1(A) OPTO2.1(A) R47.1 R65.1 R70.2 R71.1 R79.1 RF1.9 U2.8(VCC) ; supply symbol labelled VCC ; also sheet 1,3
EZ-RF_RXD: EZ-RF.6 ; also sheet 1
EZ-RF_TXD: EZ-RF.1 ; also sheet 1
IR_RXD: IRDA.P$3(RXD) ; also sheet 1
IR_SD: IRDA.P$4(SD) ; also sheet 1
IR_TXD: IRDA.P$2(TXD) ; also sheet 1
N$3: ACT.2 OPTO2.4(COL)
N$9: R65.2 U1.2(A)
N$11: ACT.1 OPTO2.3(EMIT)
N$12: OPTO2.2(C) R72.2
N$22: Q2.B R69.2
N$24: R64.1 R67.2 RS-232.2
N$26: R62.1 U1.6(VO)
N$28: Q1.B R62.2 R63.1
N$35: R74.2 RF2.3
N$41: Q1.C R64.2
N$43: R66.1 U1.7(VB)
N$45: R76.2 RF2.5
N$48: C52.1 IRDA.P$5(VCC1) R47.2
N$50: R79.2 RF1.7
N$51: R73.1 RF1.4
N$52: R87.2 RF1.15
N$53: R77.1 RF1.6
N$55: R83.1 RF2.10
N$56: R84.1 RF2.12
N$57: R85.1 RF2.14
N$58: D27.1(C) R78.1 U2.2(A)
N$59: R86.1 RF2.16
N$60: R88.1 RF2.18
N$61: R91.1 RF2.20
N$65: OPTO1.4(COL) REACT.2
N$67: D24.1(C) R78.2 RS-232.3
N$68: OPTO1.3(EMIT) REACT.1
N$69: D26.2(A) RS-232.7
N$71: D25.2(A) RS-232.4
N$72: OPTO1.2(C) R68.2
N$79: Q2.E U1.3(C)
N$81: R90.2 RF1.19
N$83: R89.1 RF1.18
N$85: R80.2 RF2.7
N$86: R82.2 RF2.9
N$87: R81.1 RF2.8
N$88: R75.1 RF2.6
REACT: JP11.1 R68.1 ; also sheet 1
RF_CCA: R83.2 ; also sheet 1
RF_CLK: R86.2 ; also sheet 1
RF_CS: R85.2 ; also sheet 1
RF_FIFO: R75.2 R80.1 ; also sheet 1
RF_FIFOP: R81.2 R82.1 ; also sheet 1
RF_GPIO1: R90.1 ; also sheet 1
RF_GPIO2: R89.2 ; also sheet 1
RF_RESETCC: R76.1 R87.1 ; also sheet 1
RF_SFD: R84.2 ; also sheet 1
RF_SIMO: R88.2 ; also sheet 1
RF_SOMI: R91.2 ; also sheet 1
RF_VREG_EN: R74.1 ; also sheet 1
RS232_RXD: RX_EN.2 ; also sheet 1
RS232_TXD: TX_EN.2 ; also sheet 1
SCL: IC1.6(SCL) ; also sheet 1
SDA: IC1.5(SDA) ; also sheet 1
UART_RX: R70.1 R71.2 RX_EN.1 U2.6(VO)
UART_TX: R69.1 TX_EN.1
Unconnected: EZ-RF.3 EZ-RF.4 RF1.1 RF1.3 RF1.5 RF1.8 RF1.10 RF1.11 RF1.12 RF1.13 RF1.14 RF1.16 RF1.17 RF1.20 RF2.2 RF2.4 RF2.11 RF2.13 RF2.15 RF2.17 RS-232.1 RS-232.6 RS-232.8 RS-232.9 U2.7(VB)

### Notes on the sheet
- Isolated RS232 Communication | IR Pulse In/Out | Act / React
- EEPROM
- EZ-RF Connect
- RF Daughter Card

## Library data of the parts
ACT JP2 JP11 JP12 REACT RX_EN TX_EN = custom_jumper:JP1E: JUMPER
AUXVCC3 = jumper:JP2E: JUMPER
BTN1-BTN4 RESET = electricalmeter:PB: OMRON SWITCH
C1-C21 C41 C45 C47 C51 C52 C54 C57 C62 = rcl:C-EU: CAPACITOR, European symbol
C22-C38 C40 C42-C44 C48 C49 C53 C59-C61 = resistor:C-EU: CAPACITOR, European symbol
C39 C46 C50 = capacitor-wima:C: CAPACITOR naming: grid - package width
C55 C56 = resistor:CPOL-US: POLARIZED CAPACITOR, American symbol
C58 C100 = rcl:CPOL-US: POLARIZED CAPACITOR, American symbol
C101 = rcl:CPOL-EU: POLARIZED CAPACITOR, European symbol
C102 = resistor:CPOL-EU: POLARIZED CAPACITOR, European symbol
D1-D16 D28-D44 = FE449x EVM:PMLL4148: DIODE high speed
D17 D19 D21 = diode:1N4757A
D18 D20 D22 = diode:1N4007
D23 = diode:ZENER-DIODE: Z-Diode
D24-D27 = semicon-smd-ipc:D-: DIODE unfilled
DGND DVCC = custom_con-lstb:MA04-1: PIN HEADER; OC_FARNELL: unknown; OC_NEWARK: unknown
EZ-RF = susbfet:SL127L6TH
HD1 = SparkFun:M02: Header 2 Standard 2-pin 0.1" header. Use with straight break away headers (SKU : PRT-00116), right angle break away headers (PRT-00553), swiss pins (PRT-00743), machine pins (PRT-00117), and female headers (PRT-00115). Molex polarized connector foot print use with SKU : PRT-08233 with associated crimp pins and housings.
I1+ I1- I2+ I2- I3+ I3- IN+ IN- LINE1-LINE3 NEUTRAL = testpad:TP: Test pad
IC1 = microchip:24C*: Serial EEPROM 1 K/2 K/4 K; MF: MICROCHIP; MPN: 24C02C/SN; OC_FARNELL: 1607552; OC_NEWARK: 96K4065
IRDA = Personal:TFBS4711-TT1
JP3-JP10 = custom_jumper:JP2E: JUMPER
JP13 = pinhead:PINHD-1X1: PIN HEADER
JTAG = con-ml:ML14: HARTING; OC_FARNELL: unknown; OC_NEWARK: unknown
L1 L3 L5 L6 = FE449x EVM:EXCELSA39: INDUCTOR SMD Bead inductor
L7 = rcl:L-US: INDUCTOR, American symbol
LCD1 = Personal:TI_160SEG_LCD
LED1-LED6 LED_ACT LED_REACT = led:LED: LED OSRAM: - CHIPLED LG R971, LG N971, LY N971, LG Q971, LY Q971, LO R971, LY R971 LH N974, LH R974 LS Q976, LO Q976, LY Q976 LO Q996 - Hyper CHIPLED LW Q18S LB Q993, LB Q99A, LB R99A - SideLED LS A670, LO A670, LY A670, LG A670, LP A670 LB A673, LV A673, LT A673, LW A673 LH A674 LY A675 LS A676, LA A676, LO A676, LY A676, LW A676 LS A679, LY A679, LG A679 - Hyper Micro SIDELED® LS Y876, LA Y876, LO Y876, LY Y876 LT Y87S - SmartLED LW L88C, LW L88S LB L89C, LB L89S, LG L890 LS L89K, LO L89K, LY L89K LS L896, LA L896, LO L896, LY L896 - TOPLED LS T670, LO T670, LY T670, LG T670, LP T670 LSG T670, LSP T670, LSY T670, LOP T670, LYG T670 LG T671, LOG T671, LSG T671 LB T673, LV T673, LT T673, LW T673 LH T674 LS T676, LA T676, LO T676, LY T676, LB T676, LH T676, LSB T676, LW T676 LB T67C, LV T67C, LT T67C, LS T67K, LO T67K, LY T67K, LW E67C LS E67B, LA E67B, LO E67B, LY E67B, LB E67C, LV E67C, LT E67C LW T67C LS T679, LY T679, LG T679 LS T770, LO T770, LY T770, LG T770, LP T770 LB T773, LV T773, LT T773, LW T773 LH T774 LS E675, LA E675, LY E675, LS T675 LS T776, LA T776, LO T776, LY T776, LB T776 LHGB T686 LT T68C, LB T68C - Hyper Mini TOPLED® LB M676 - Mini TOPLED Santana® LG M470 LS M47K, LO M47K, LY M47K Source: http://www.osram.convergy.de LUXEON: - LUMILED® LXK2-PW12-R00, LXK2-PW12-S00, LXK2-PW14-U00, LXK2-PW14-V00 LXK2-PM12-R00, LXK2-PM12-S00, LXK2-PM14-U00 LXK2-PE12-Q00, LXK2-PE12-R00, LXK2-PE12-S00, LXK2-PE14-T00, LXK2-PE14-U00 LXK2-PB12-K00, LXK2-PB12-L00, LXK2-PB12-M00, LXK2-PB14-N00, LXK2-PB14-P00, LXK2-PB14-Q00 LXK2-PR12-L00, LXK2-PR12-M00, LXK2-PR14-Q00, LXK2-PR14-R00 LXK2-PD12-Q00, LXK2-PD12-R00, LXK2-PD12-S00 LXK2-PH12-R00, LXK2-PH12-S00 LXK2-PL12-P00, LXK2-PL12-Q00, LXK2-PL12-R00 Source: www.luxeon.com KINGBRIGHT: KA-3528ASYC Source: www.kingbright.com
MSP430F67791 = Personal:MSP430F6779IPEU: MSP430F6779IPEU
OPTO1 OPTO2 = optocoupler:TIL191: TEXAS INSTRUMENTS OPTO COUPLER; OC_FARNELL: 1683363; OC_NEWARK: unknown
Q1 Q2 = transistor-pnp:BC857*: PNP Transistror
R1-R3 = varistor:S20K275: VARISTOR
R4-R19 R24-R34 R36 R39 R99-R103 = _MSP430:RES
R20-R23 R35 R37 R38 R92-R95 = resistor:R-US_: RESISTOR, American symbol
R40 R41 R47 R62-R91 = rcl:R-EU_: RESISTOR, European symbol
R42-R46 R48-R61 = resistor:R-EU_: RESISTOR, European symbol
R96-R98 R/L7-R/L14 = rcl:R-US_: RESISTOR, American symbol
RF1 RF2 = _MSP430:TFM-110-02-SM-D-A-K
RS-232 = con-subd:F09VP: SUB-D; OC_FARNELL: unknown; OC_NEWARK: unknown
SV1 = jumper:JP2Q: JUMPER
SV2 = con-lstb:MA05-1: PIN HEADER; OC_FARNELL: unknown; OC_NEWARK: unknown
TVS1-TVS4 = FE449x EVM:SMAJ5.0CA
U1 U2 = FE449x EVM:PS8802: MOTOROLA OPTO COUPLER
U3 = TPS54060:TPS54060_DGQ_10; DATASHEETURL: http://www.ti.com/lit/gpn/TPS54060; DESCRIPTION: 3.5V to 60V Input, 0.5A Step-Down Converter with Eco-Mode; FAMILY_NAME: STEP-DOWN REGULATOR; GENERIC_PART_NUMBER: TPS54060; INDUSTRY_STD_PKG_TYPE: MSOP-PowerPAD; MANUFACTURER: Texas Instruments; MANUFACTURER_PART_NUMBER: tps54060_dgq_10; PACKAGE_DESIGNATOR: DGQ; PIN_COUNT: 10; VENDOR: Texas Instruments
U$1 = TI_MSP430_v16_intern:CUI_XR
XT1 = F20xx PIR Demo & Eval:CM200T
ZD3 = diode:DIODE-: DIODE